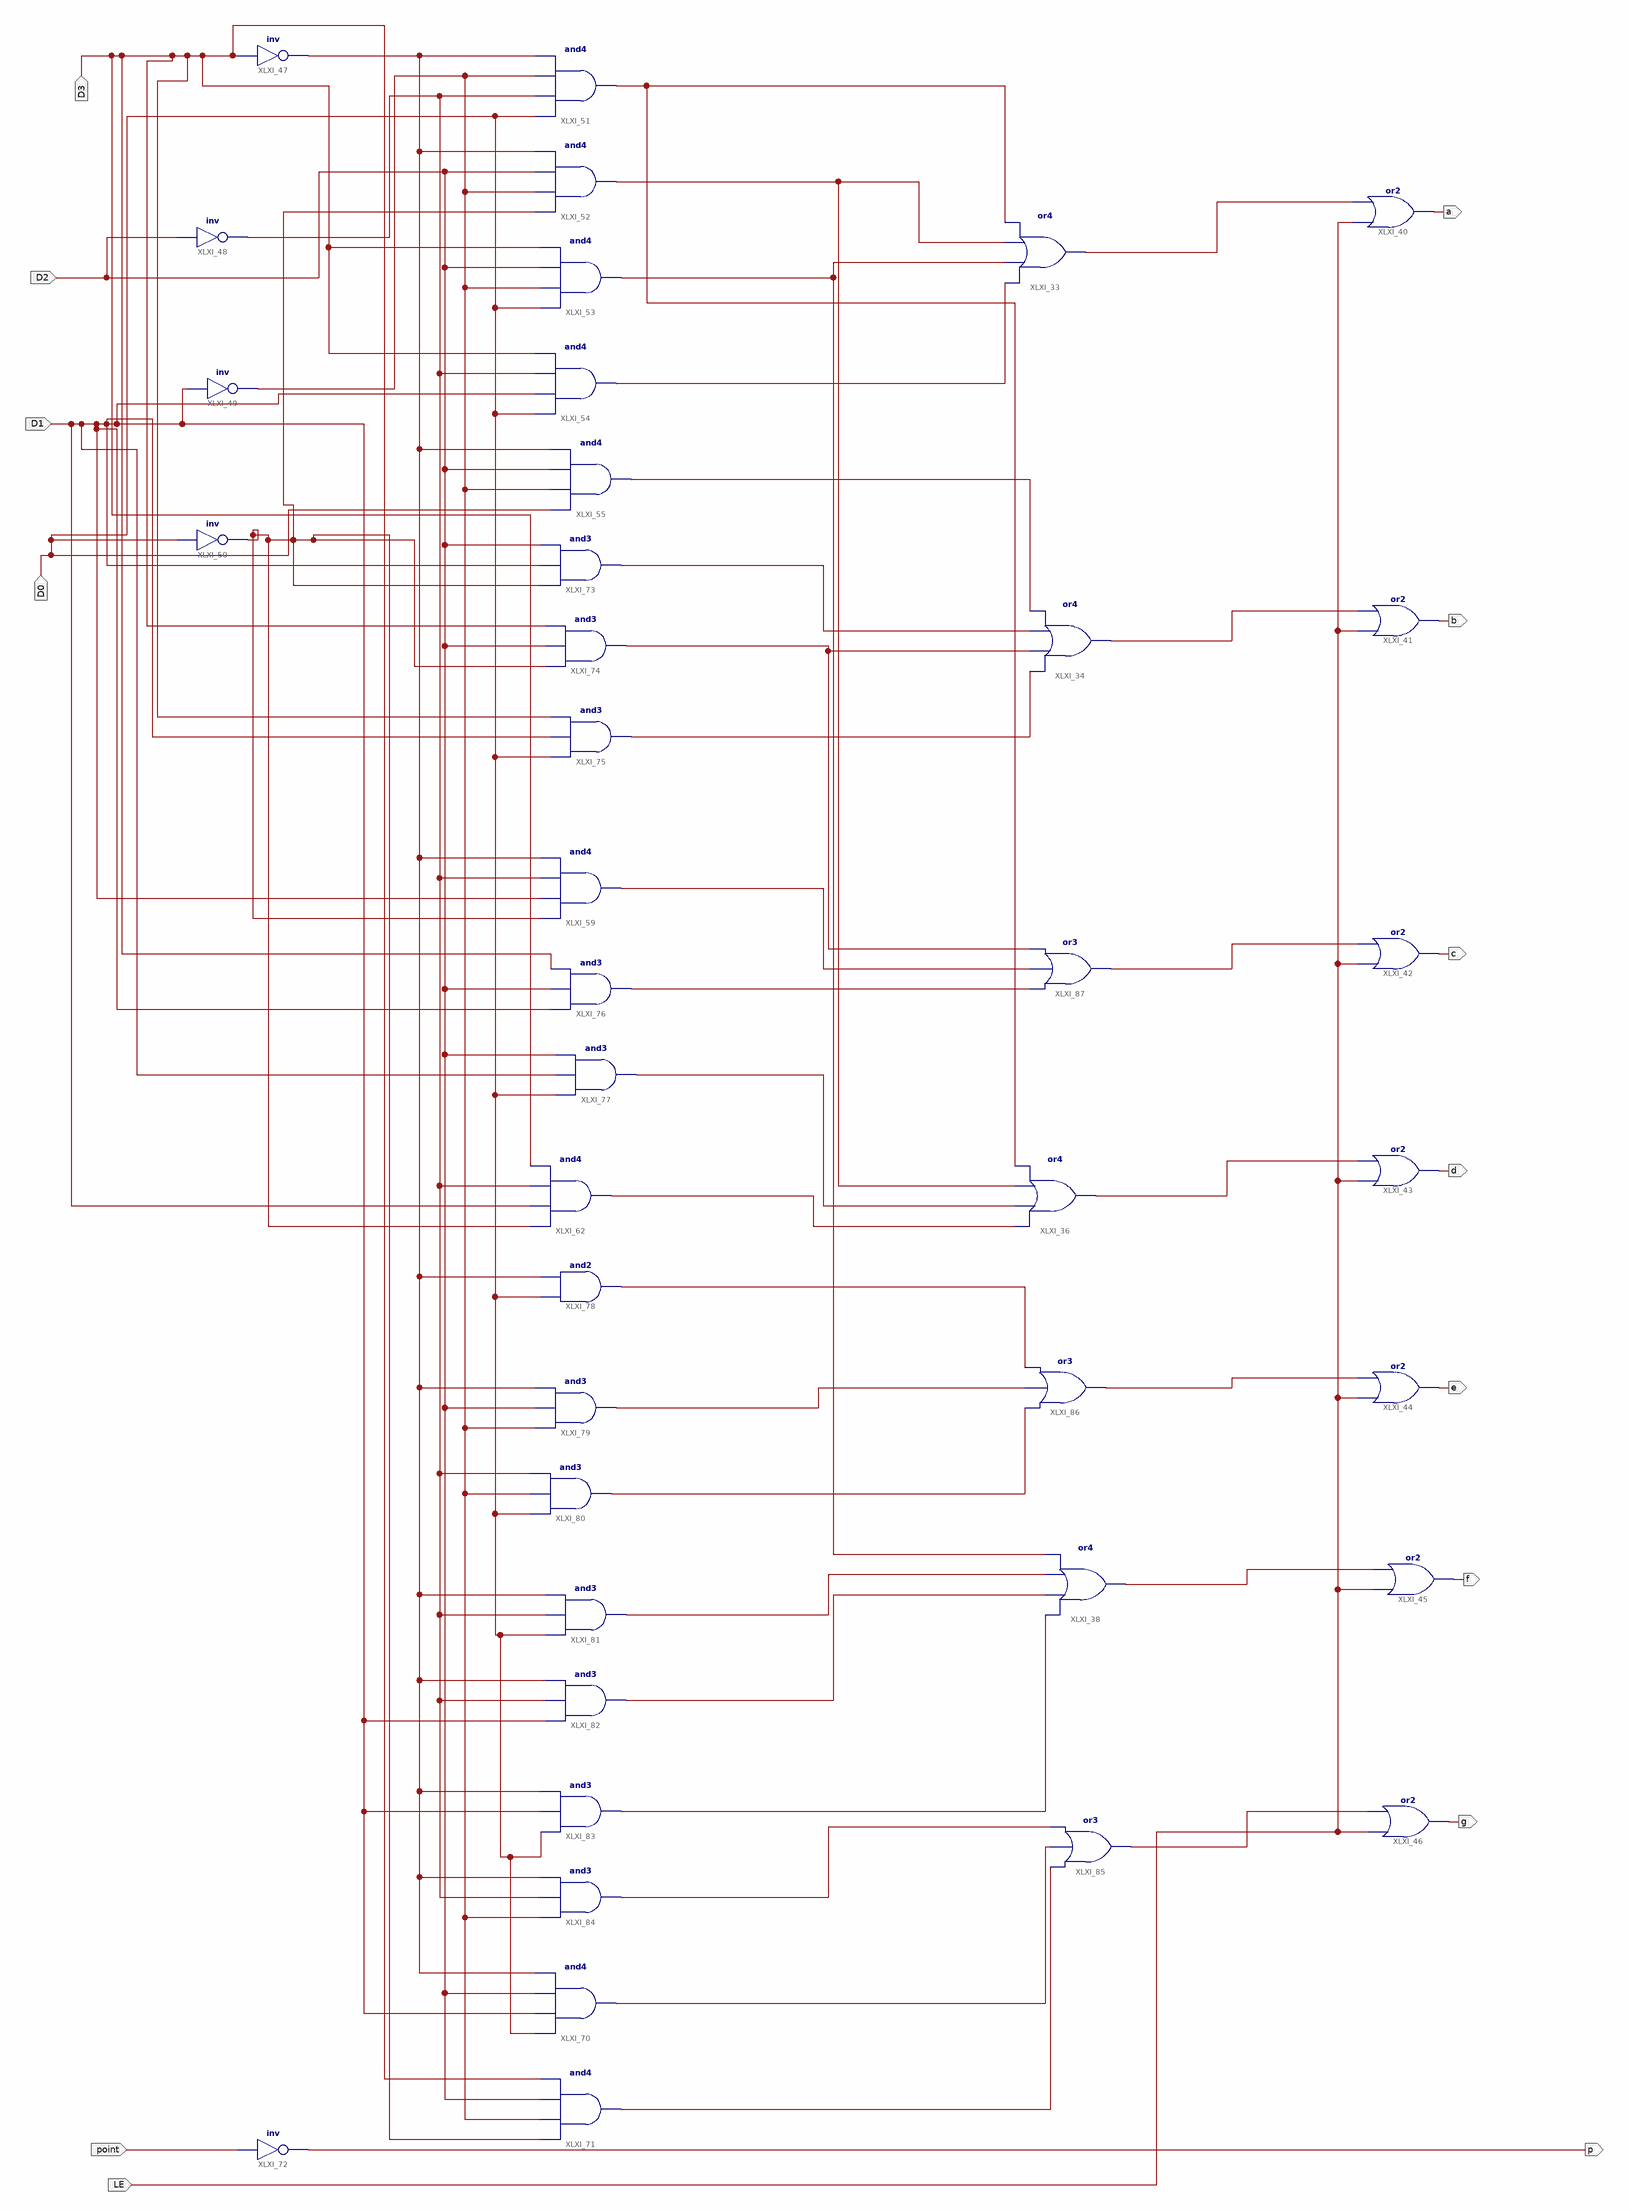
[diagram p0: schematic sheet 1]
// Xilinx ISE schematic MC14495_ZJU.sch (kintex7) as structural Verilog: 40 symbols, 14 ports
module MC14495_ZJU (
  input  D3,
  input  D0,
  input  D2,
  input  D1,
  input  point,
  input  LE,
  output p,
  output a,
  output b,
  output c,
  output d,
  output e,
  output f,
  output g
);

  wire XLXN_12, XLXN_55, XLXN_79, XLXN_80, XLXN_81, XLXN_82, XLXN_83, XLXN_84, XLXN_86, XLXN_87, XLXN_88,
       XLXN_90, XLXN_91, XLXN_92, XLXN_93, XLXN_94, XLXN_95, XLXN_96, XLXN_97, XLXN_98, XLXN_99, XLXN_100,
       XLXN_101, XLXN_103, XLXN_104, XLXN_105, XLXN_106, XLXN_107, XLXN_108, XLXN_109, XLXN_143, XLXN_154;

  or XLXI_33 (XLXN_103, XLXN_100, XLXN_101, XLXN_92, XLXN_93);
  or XLXI_34 (XLXN_104, XLXN_97, XLXN_96, XLXN_98, XLXN_99);
  or XLXI_36 (XLXN_106, XLXN_90, XLXN_91, XLXN_92, XLXN_93);
  or XLXI_38 (XLXN_108, XLXN_82, XLXN_83, XLXN_84, XLXN_101);
  or XLXI_40 (a, LE, XLXN_103);
  or XLXI_41 (b, LE, XLXN_104);
  or XLXI_42 (c, LE, XLXN_105);
  or XLXI_43 (d, LE, XLXN_106);
  or XLXI_44 (e, LE, XLXN_107);
  or XLXI_45 (f, LE, XLXN_108);
  or XLXI_46 (g, LE, XLXN_109);
  not XLXI_47 (XLXN_12, D3);
  not XLXI_48 (XLXN_154, D2);
  not XLXI_49 (XLXN_143, D1);
  not XLXI_50 (XLXN_55, D0);
  and XLXI_51 (XLXN_93, D0, XLXN_154, XLXN_143, XLXN_12);
  and XLXI_52 (XLXN_92, XLXN_55, XLXN_143, D2, XLXN_12);
  and XLXI_53 (XLXN_101, D0, XLXN_143, D2, D3);
  and XLXI_54 (XLXN_100, D0, D1, XLXN_154, D3);
  and XLXI_55 (XLXN_99, D0, XLXN_143, D2, XLXN_12);
  and XLXI_59 (XLXN_95, XLXN_55, D1, XLXN_154, XLXN_12);
  and XLXI_62 (XLXN_90, XLXN_55, D1, XLXN_154, D3);
  and XLXI_70 (XLXN_80, D0, D1, D2, XLXN_12);
  and XLXI_71 (XLXN_79, XLXN_55, XLXN_143, D2, D3);
  not XLXI_72 (p, point);
  and XLXI_73 (XLXN_98, XLXN_55, D1, D2);
  and XLXI_74 (XLXN_96, XLXN_55, D2, D3);
  and XLXI_75 (XLXN_97, D0, D1, D3);
  and XLXI_76 (XLXN_94, D1, D2, D3);
  and XLXI_77 (XLXN_91, D0, D1, D2);
  and XLXI_78 (XLXN_88, D0, XLXN_12);
  and XLXI_79 (XLXN_87, XLXN_143, D2, XLXN_12);
  and XLXI_80 (XLXN_86, D0, XLXN_143, XLXN_154);
  and XLXI_81 (XLXN_84, D0, XLXN_154, XLXN_12);
  and XLXI_82 (XLXN_83, D1, XLXN_154, XLXN_12);
  and XLXI_83 (XLXN_82, D0, D1, XLXN_12);
  and XLXI_84 (XLXN_81, XLXN_143, XLXN_154, XLXN_12);
  or XLXI_85 (XLXN_109, XLXN_79, XLXN_80, XLXN_81);
  or XLXI_86 (XLXN_107, XLXN_86, XLXN_87, XLXN_88);
  or XLXI_87 (XLXN_105, XLXN_94, XLXN_95, XLXN_96);
endmodule
